# Altium schematic sheet MAPLE_CDH_Periph.SchDoc
size A4; SheetNumber: 2; SheetTotal: 2
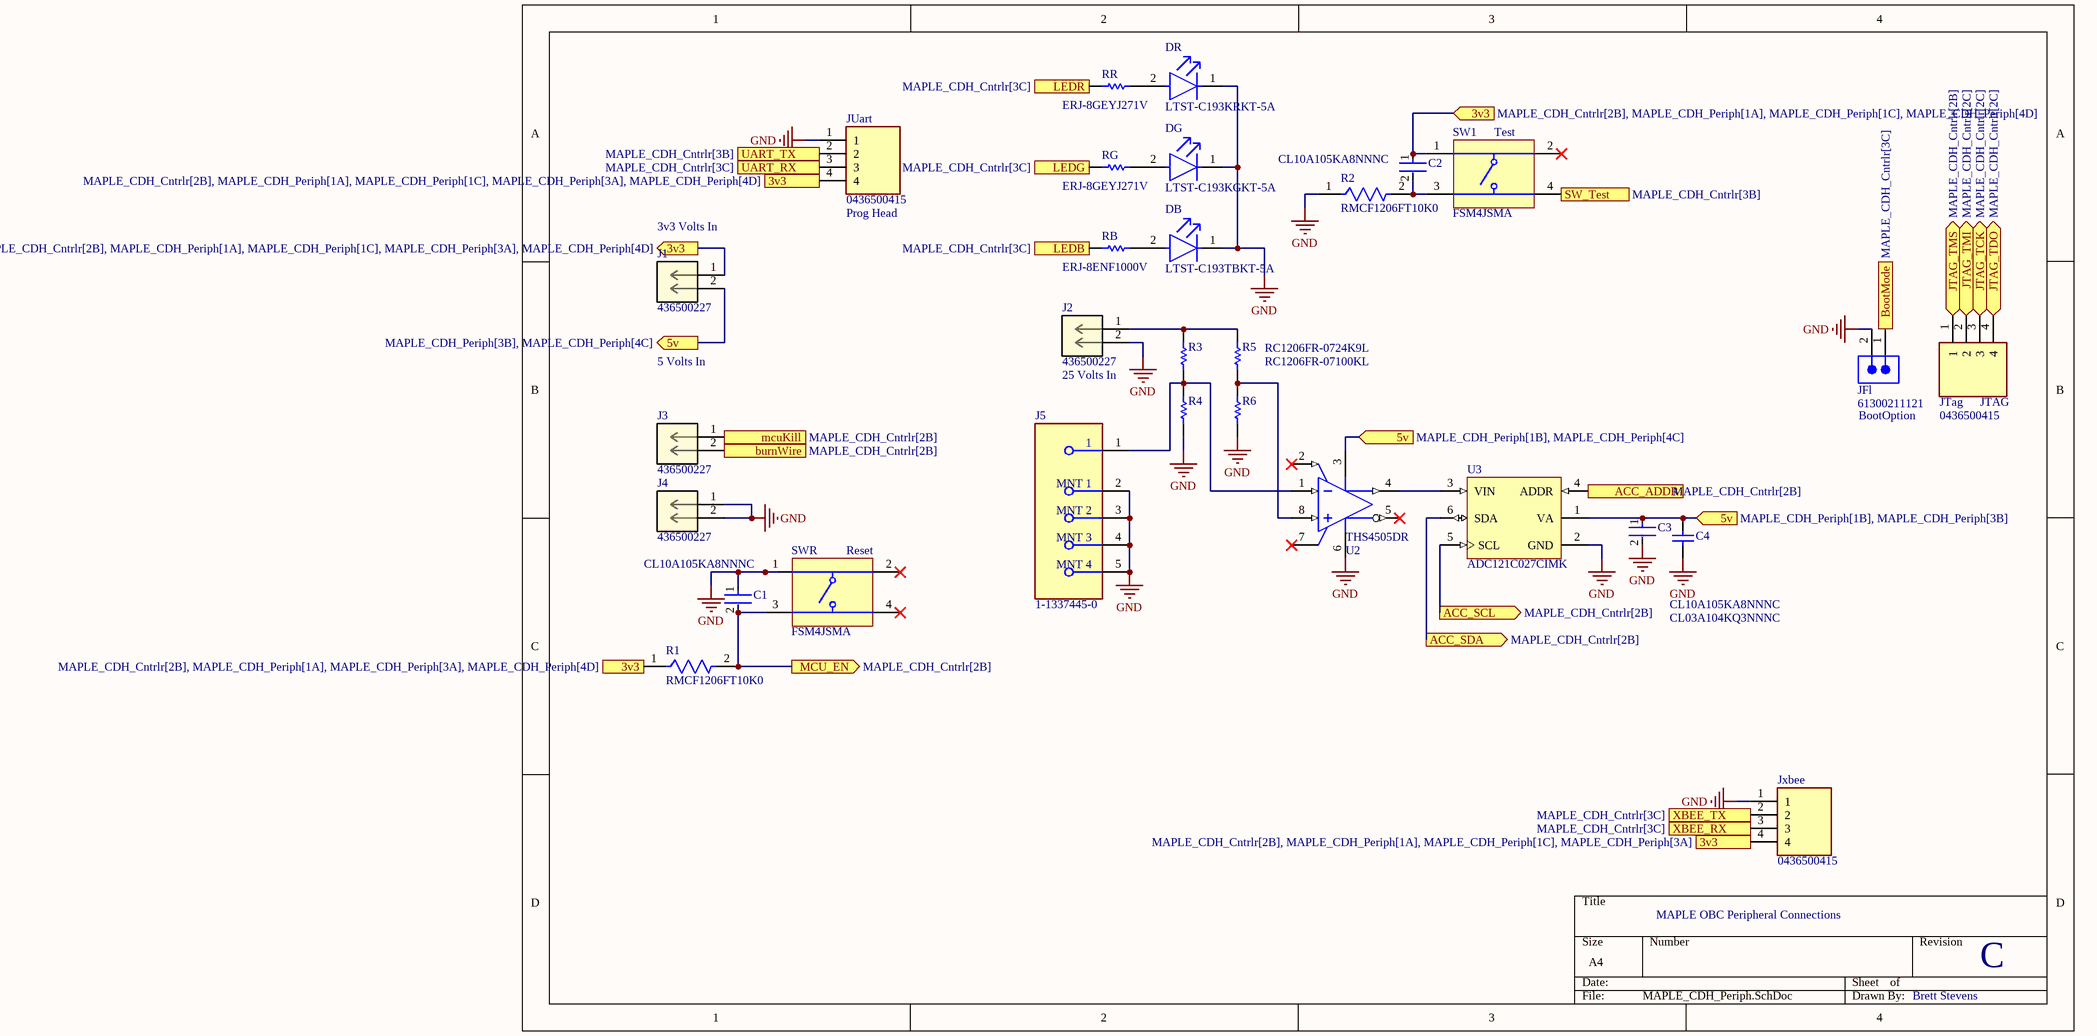
[diagram p0: MAPLE_CDH_Periph.SchDoc]

## Parts
C1  CL10A105KA8NNNC  [FP-CL10-IPC_C]
C2  CL10A105KA8NNNC  [FP-CL10-IPC_C]
C3  CL10A105KA8NNNC  [FP-CL10-IPC_C]
C4  CL03A104KQ3NNNC  [CAPC0603X33X15ML03T05]
DB  LTST-C193TBKT-5A  [FP-LTST-C193TBKT-5A-MFG]
DG  LTST-C193KGKT-5A  [FP-LTST-C193KGKT-5A-MFG]
DR  LTST-C193KRKT-5A  [FP-LTST-C193KRKT-5A-MFG]
J1  436500227  [CON_436500227_MOL]
J2  436500227  [CON_436500227_MOL]
J3  436500227  [CON_436500227_MOL]
J4  436500227  [CON_436500227_MOL]
J5  1-1337445-0  [FP-1-1337445-0-MFG]
JFl  61300211121  [61300211121]
JTag  0436500415  [MOLEX_0436500415]
JUart  0436500415  [MOLEX_0436500415]
Jxbee  0436500415  [MOLEX_0436500415]
R1  RMCF1206FT10K0  [FP-RMCF1206-IPC_B]
R2  RMCF1206FT10K0  [FP-RMCF1206-IPC_B]
R3  (no value)  [RESC3116X65X40NL10T20]
R4  (no value)  [RESC3116X65X40ML10T20]
R5  RC1206FR-0724K9L  [RESC3116X65X40NL10T20]
R6  RC1206FR-07100KL  [RESC3116X65X40ML10T20]
RB  ERJ-8ENF1000V  [RESC3216X70X50NL05T20]
RG  ERJ-8GEYJ271V  [RESC3216X70X50NL05T20]
RR  ERJ-8GEYJ271V  [RESC3216X70X50NL05T20]
SW1  FSM4JSMA  [TECO-FSM4JSMA_V]
SWR  FSM4JSMA  [TECO-FSM4JSMA_V]
U2  THS4505DR  [D0008A_L]
U3  ADC121C027CIMK  [MK06A_N]

## Ports
3v3 (in, see MAPLE_CDH_Cntrlr[2B], MAPLE_CDH_Periph[1A], MAPLE_CDH_Periph[1C], MAPLE_CDH_Periph[3A]), 3v3 (in, see MAPLE_CDH_Cntrlr[2B], MAPLE_CDH_Periph[1A], MAPLE_CDH_Periph[1C], MAPLE_CDH_Periph[3A], MAPLE_CDH_Periph[4D]), 3v3 (in, see MAPLE_CDH_Cntrlr[2B], MAPLE_CDH_Periph[1A], MAPLE_CDH_Periph[1C], MAPLE_CDH_Periph[4D]), 3v3 (in, see MAPLE_CDH_Cntrlr[2B], MAPLE_CDH_Periph[1A], MAPLE_CDH_Periph[3A], MAPLE_CDH_Periph[4D]), 3v3 (out, see MAPLE_CDH_Cntrlr[2B], MAPLE_CDH_Periph[1A], MAPLE_CDH_Periph[1C], MAPLE_CDH_Periph[3A], MAPLE_CDH_Periph[4D]), 5v (in, see MAPLE_CDH_Periph[1B], MAPLE_CDH_Periph[3B]), 5v (in, see MAPLE_CDH_Periph[1B], MAPLE_CDH_Periph[4C]), 5v (out, see MAPLE_CDH_Periph[3B], MAPLE_CDH_Periph[4C]), ACC_ADDR (in, see MAPLE_CDH_Cntrlr[2B]), ACC_SCL (out, see MAPLE_CDH_Cntrlr[2B]), ACC_SDA (out, see MAPLE_CDH_Cntrlr[2B]), BootMode (out, see MAPLE_CDH_Cntrlr[3C]), burnWire (in, see MAPLE_CDH_Cntrlr[2B]), JTAG_TCK (bidir, see MAPLE_CDH_Cntrlr[2C]), JTAG_TDO (bidir, see MAPLE_CDH_Cntrlr[2C]), JTAG_TMI (bidir, see MAPLE_CDH_Cntrlr[2C]), JTAG_TMS (bidir, see MAPLE_CDH_Cntrlr[2B]), LEDB (in, see MAPLE_CDH_Cntrlr[3C]), LEDG (in, see MAPLE_CDH_Cntrlr[3C]), LEDR (in, see MAPLE_CDH_Cntrlr[3C]), MCU_EN (out, see MAPLE_CDH_Cntrlr[2B]), mcuKill (in, see MAPLE_CDH_Cntrlr[2B]), SW_Test (out, see MAPLE_CDH_Cntrlr[3B]), UART_RX (out, see MAPLE_CDH_Cntrlr[3C]), UART_TX (in, see MAPLE_CDH_Cntrlr[3B]), XBEE_RX (out, see MAPLE_CDH_Cntrlr[3C]), XBEE_TX (in, see MAPLE_CDH_Cntrlr[3C])

## Nets
GND: C1.1 C3.2 C4.1 DB.1(C) DG.1(C) DR.1(C) J2.2 J4.1 J4.2 J5.2(MNT_1) J5.3(MNT_2) J5.4(MNT_3) J5.5(MNT_4) JFl.2 JUart.1 Jxbee.1 R2.1 R4.1 R6.1 SWR.1 U2.6(VS-) U3.2(GND)
3v3: C2.1 J1.1 JUart.4 Jxbee.4 R1.1 SW1.1 ; port 3v3
5v: C3.1 C4.2 J1.2 U2.3(VS+) U3.1(VA) ; port 5v
ACC_ADDR: U3.4(ADDR) ; port ACC_ADDR
ACC_SCL: U3.5(SCL) ; port ACC_SCL
ACC_SDA: U3.6(SDA) ; port ACC_SDA
BootMode: JFl.1 ; port BootMode
burnWire: J3.2 ; port burnWire
JTAG_TCK: JTag.3 ; port JTAG_TCK
JTAG_TDO: JTag.4 ; port JTAG_TDO
JTAG_TMI: JTag.2 ; port JTAG_TMI
JTAG_TMS: JTag.1 ; port JTAG_TMS
LEDB: RB.1 ; port LEDB
LEDG: RG.1 ; port LEDG
LEDR: RR.1 ; port LEDR
MCU_EN: C1.2 R1.2 SWR.3 ; port MCU_EN
mcuKill: J3.1 ; port mcuKill
SW_Test: SW1.4 ; port SW_Test
UART_RX: JUart.3 ; port UART_RX
UART_TX: JUart.2 ; port UART_TX
XBEE_RX: Jxbee.3 ; port XBEE_RX
XBEE_TX: Jxbee.2 ; port XBEE_TX
NetC2_2: C2.2 R2.2 SW1.3
NetDB_2: DB.2(A) RB.2
NetDG_2: DG.2(A) RG.2
NetDR_2: DR.2(A) RR.2
NetJ2_1: J2.1 R3.2 R5.2
NetJ5_1: J5.1 R3.1 R4.2 U2.1(VIN-)
NetR5_1: R5.1 R6.2 U2.8(VIN+)
NetU2_4: U2.4(VOUT+) U3.3(VIN)

Not connected (* = marked no-connect by the designer): SW1 2*; SWR 2* 4*; U2 2(VOCM)* 5(VOUT-)* 7(NC)*

## Notes on the sheet
- (near SW1) Test
- (near J1) 3v3 Volts In
- (near JUart) Prog Head
- 5 Volts In
- (near J2) 25 Volts In
- BootOption
- JTAG
- (near SWR) Reset
- MAPLE OBC Peripheral Connections
- C
- Brett Stevens

## Library data of the parts
C1-C3 = CMP-13271-004127-1: Cap Ceramic 1uF 25V X5R ±10% Pad SMD 0603 +85°C T/R; Height: 0.8mm; Capacitance: 1uF; Depth: 0.8mm; Package Quantity: 1; Mount: Surface Mount; Contact Plating: Tin; Voltage Rating: 25V; Dielectric: X5R; Packaging: Tape and Reel; Material: Ceramic; Case Code (Metric): 1608; Length: 1.6mm; Voltage: 25V; Min Operating Temperature: -55°C; Width: 0.031inch; Tolerance: 10%; Case/Package: 0603; Radiation Hardening: No; Case Code (Imperial): 0603; Thickness: 0.035inch; Lead Free: Lead Free; Max Operating Temperature: 85°C; Voltage Rating (DC): 25V
C4 = CMP-2010-00674-1: Manufacturer: Samsung; Part Number: CL03A104KQ3NNNC
DB = CMP-2000-06624-2: LED BLUE CLEAR CHIP SMD; Number of Elements: 1; Forward Voltage: 2.8V; Forward Current: 20mA; Test Current: 5mA; Lens Color: Colorless; Dominant Wavelength: 475nm; Reverse Voltage: 5V; Viewing Angle: 130°; Lens Style: Diffused; Luminous Intensity: 15mcd; Power Dissipation: 76mW; Max Operating Temperature: 80°C; Length: 1.6mm; Number of LEDs: 1; Case/Package: 0603; Case Code (Metric): 1608; Number of Pins: 2; Radiation Hardening: No; Min Operating Temperature: -20°C; Width: 0.8mm; Packaging: Tape and Reel; Package Quantity: 1; Lead Free: Lead Free; Lens Transparency: Clear; Illumination Color: Blue; Color: Blue; RoHS Compliant: Yes; Mount: Surface Mount; Depth: 0.8mm; Case Code (Imperial): 0603; Height: 0.35mm
DG = CMP-2000-06622-2: LED GREEN CLEAR CHIP SMD; Forward Current: 30mA; Power Dissipation: 75mW; Luminous Intensity: 28mcd; Lens Style: Diffused; Lens Color: Colorless; Forward Voltage: 2.3V; Test Current: 5mA; Viewing Angle: 130°; Reverse Voltage: 5V; Dominant Wavelength: 576.5nm; Number of Elements: 1; Number of Pins: 2; Case/Package: 0603; Width: 0.8mm; Radiation Hardening: No; Lead Free: Lead Free; Lens Transparency: Clear; Max Operating Temperature: 85°C; Illumination Color: Green; Color: Green; Packaging: Tape and Reel; Depth: 0.8mm; Length: 1.6mm; Mount: Surface Mount; Case Code (Imperial): 0603; Height: 0.35mm; Min Operating Temperature: -55°C; Package Quantity: 3000; Case Code (Metric): 1608; Power Rating: 75mW; Number of LEDs: 1
DR = CMP-2000-06623-2: LED RED CLEAR CHIP SMD; Power Dissipation: 50mW; Lens Style: Diffused; Test Current: 5mA; Dominant Wavelength: 631nm; Reverse Voltage: 5V; Number of Elements: 1; Viewing Angle: 130°; Luminous Intensity: 45mcd; Lens Color: Colorless; Forward Voltage: 2.3V; Case Code (Imperial): 0603; Illumination Color: Red; Lead Free: Lead Free; Radiation Hardening: No; Width: 0.8mm; Number of Pins: 2; Packaging: Tape and Reel; Depth: 0.8mm; Height: 0.35mm; Mount: Surface Mount; Case Code (Metric): 1608; Forward Current: 5mA; Lens Transparency: Clear; Case/Package: 0603; Length: 1.6mm; Color: Red; Max Operating Temperature: 85°C; Number of LEDs: 1; Min Operating Temperature: -55°C; Package Quantity: 3000
J1-J4 = 436500227: No Description Available; Mfr_Name: Molex Connector Corporation; Copyright: Copyright (C) 2023 Ultra Librarian. All rights reserved.; Manufacturer_Part_Number: 436500227; Digi-Key_Part_Number_1: WM10656-ND; RefDes: RefDes; Type: DEV
J5 = CMP-03357-000006-1: CONN BNC JACK STR 50 OHM PCB; PCB Mount Retention: With; Operating Frequency: 0 to 4Hz; PCB Mounting Orientation: Vertical; PCB Thickness: 0.126inch; Body Plating: Silver; Frequency: 4GHz; Impedance: 50R; Insulation Resistance: 5GR; Body Material: Brass; Dielectric Material: PTFE; Gender: Female; Sealable: No (Without); Number of Positions: 1; Orientation: Straight; RoHS Compliant: Yes; Min Operating Temperature: -65°C; Packaging: Bag; Fastening Type: Bayonet; Radiation Hardening: No; Max Frequency: 4GHz; Material: Brass; Contact Plating: Silver; ELV: Compliant; Depth: 12mm; Series: BNC; Package Quantity: 50; Connector Type: BNC; Contact Material: Brass; Max Operating Temperature: 165°C; Length: 12mm; Termination: Solder; Mount: Through Hole; Insulation Material: Polytetrafluoroethylene
JFl = CMP-1712-00002-5: NexarPartId: 20081794; Operating Supply Voltage: 250V; Current Rating: 3A; Gender: Male; Number of Contacts: 2; Pitch: 2.54mm; Connector Type: Male Pin; Contact Resistance: 20mΩ; Contact Plating: Gold; Contact Material: Copper; Number of Pins: 2; Min Operating Temperature: -40°C; Packaging: Bulk; Lead Pitch: 2.54mm; Mount: Through Hole; Orientation: Vertical; RoHS: Compliant; REACH SVHC: No SVHC; Height: 8.94mm; Termination: Through Hole; Number of Positions: 2; Contact Mating Length: 5.9944mm; Color: Black; Contact Gender: Male; Number of Rows: 1; Housing Material: PBT; Lead Free: Lead Free; Voltage Rating: 250V; Max Operating Temperature: 125°C
JTag JUart Jxbee = 0436500415: Connector Header Through Hole 4 position 0.118 (3.00mm); MF: Molex; MP: 0436500415; Price: None; SnapEDA_Link: https://www.snapeda.com/parts/0436500415/Molex/view-part/425083/?ref=snap; Availability: Unavailable; Value: *; Package: None
R1 R2 = CMP-26527-000151-1: 10kΩ ±1% 0.25W 1206 Thick Film Chip Resistor AEC-Q200 compliant; Resistance: 10kR; Temperature Coefficient: 100ppm/°C; Max Power Dissipation: 250mW; Packaging: Tape and Reel; Resistor Type: Thick Film; Number of Terminations: 2; Depth: 1.6mm; Military Standard: Not; Contact Plating: Tin; Radiation Hardening: No; Lead Free: Lead Free; Tolerance: 1%; Length: 3.2mm; Size Code: 1206; RoHS Compliant: Yes; Case/Package: 1206; Mount: Surface Mount; Features: Automotive AEC-Q200; Min Operating Temperature: -55°C; Series: RMCF; Case Code (Imperial): 1206; Construction: Rectangular; Max Operating Temperature: 155°C; Width: 0.063inch; Height: 0.028inch; Power Rating: 250mW; Case Code (Metric): 3216
R3 = CMP-2003-03636-1: Manufacturer: Yageo; Part Number: RC1206FR-0724K9L
R4 R6 = CMP-2100-03674-1: Chip Resistor, 100 KOhm, +/- 1%, 0.25 W, -55 to 155 degC, 1206 (3216 Metric), RoHS, Tape and Reel; Manufacturer: Yageo; Voltage Rating: 200V; Temperature Coefficient: 100ppm/degreesC; Power Rating: 250mW; Case Code (Metric): 3216; Composition: ThickFilm; Lead Free: LeadFree; Max Operating Temperature: 155degC; Case/Package: 1206; Min Operating Temperature: -55degC; Depth: 1.6mm; RoHSCompliant: true; Datasheet URL: http://www.yageo.com/NewPortal/yageodocoutput?fileName=/pdf/R-Chip/PYu-RC_Group_51_RoHS_L_5.pdf; Datasheet Version: Rev. 5, 10/2016; Package Reference: 1206.0; Packaging: TapeandReel; Resistance: 100KOhm; Manufacturer URL: http://www.yageo.com/; Tolerance: 1%; Height: 0.55mm; REACH SVHC: NoSVHC; Case Code (Imperial): 1206; Length: 3.1mm; Package Description: 2-Pin Surface Mount Device, Body 3.1 x 1.6 mm; Termination: SMD/SMT
R5 = CMP-2003-03636-1: Manufacturer: Yageo; Part Number: RC1206FR-0724K9L
RB = CMP-2003-00016-1: Manufacturer: Panasonic; Part Number: ERJ-8ENF1000V
RG RR = CMP-2003-00597-1: Manufacturer: Panasonic; Part Number: ERJ-8GEYJ271V
SW1 SWR = CMP-2000-05602-2: Swicth, SPST, 24 V, -35 to 85 degC, 4-Pin SMD, RoHS, Tape and Reel; Manufacturer: TE Connectivity; Switch Travel: 0.25mm; Mechanical Life: 100000Cycles; Contact Current Rating: 50mA; Operating Force: 1.57N; Actuator Material: Polyamide; Contact Resistance: 100mOhm; Voltage Rating: 24V; Illumination Type: Illuminated; Actuator Length: 0.055inch; Max Voltage Rating (DC): 12V; Case\/Package: SMD/SMT; Orientation: Straight; Datasheet URL: http://www.te.com/commerce/DocumentDelivery/DDEController?Action=showdoc&DocId=Customer+Drawing%7F2-1437565-7%7FV%7Fpdf%7FEnglish%7FENG_CD_2-1437565-7_V.pdf%7F4-1437565-2; Min Operating Temperature: -35degC; Packaging: LoosePiece; Termination: GullWing; Throw Configuration: SPST; Package Description: 4-Pin Surface Mount Device, Body 6 x 6 mm, Pitch 4.5 mm; Mounting Technology: SurfaceMount; Contact Plating: Silver; Datasheet Version: Rev. V, 02/2015; RoHSCompliant: true; Max Operating Temperature: 85degC; Length: 6mm; Voltage Rating (DC): 24V; Electrical Life: 100000Cycles; Current Rating: 50mA; Package Quantity: 750; Mount: SurfaceMount; Package Reference: FSM4JSMA; Manufacturer URL: http://www.te.com/; Width: 6mm; REACH SVHC: Unknown; Contact Material: CopperAlloy
U2 = CMP-0811-00031-2: Wideband, Low-Distortion Fully Differential Amplifier, 4.5 to 15 V, -40 to 85 degC, 8-pin SOIC (D8), Green (RoHS & no Sb/Br); Manufacturer: Texas Instruments; 3rd Harmonic(dBc): 65; @ MHz: 30; BW @ Acl(MHz): 260; THD (Fc is 1 MHz)(Typ)(dB): -78; Offset Voltage Drift (+/-)(Max)(uV/Degrees Celsius: 10; Vn at Flatband(Typ)(nV/rtHz): 8; Vio(Max)(mV): -7; Vs(Min)(V): 4.5; Vs(Max)(V): 15; Number of Channels: 1; Io(Typ)(mA): 100; Iq per channel(Max)(mA): 21; Slew Rate(Typ)(V/us): 1800; 2nd Harmonic(dBc): 66; Settling Time (0.1%)(Typ)(ns): 20; ComponentLink3Description: Package Specification; ComponentLink1URL: http://www.ti.com/; DatasheetVersion: SLOS363D; Eco-Plan: Green (RoHS & no Sb/Br); SubFamily: Fully Differential Amplifier; ComponentLink2Description: Datasheet; ComponentLink1Description: Manufacturer URL; PartNumber: THS4505DR; Code_JEDEC: MS-012; ComponentLink2URL: http://www.ti.com/general/docs/lit/getliterature.tsp?genericPartNumber=THS4505&fileType=pdf; Mounting Technology: Surface Mount; ComponentLink3URL: http://www.ti.com/litv/pdf/msoi002j; PackageDescription: 8-Pin Plastic Small Outline, Body 4.9 x 3.9 mm, Pitch 1.27 mm; PackageReference: D0008A; PackageVersion: 4040047-3/M, 06/2011
U3 = CMP-0054-00264-2: I2C-Compatible, 12-Bit Analog-to-Digital Converter with Alert Function, 6-pin Tiny SOT23; Manufacturer: National Semiconductor; PackageTopMarking: X31C*XTT; PowerWise: Y; CompType: ADC IC; PackageVersion: revE, Nov-2008; ComponentLink1URL: http://www.national.com/ds/AD/ADC121C027.pdf; Code_IPC: SOT26A-6; ComponentLink3Description: MK06A Package Page; Code_JEDEC: MO-193-AA; ComponentLink2Description: ADC121C027 Web Page; ComponentLink1Description: ADC121C027 Datasheet; RevisionNote: Component URLs added; DatasheetVersion: Apr-2009; RoHS: N; PackageDescription: Molded TSOT, 2.97 x 1.65 x 0.87mm Body, 6 Lead, 0.95mm Pitch; ComponentLink3URL: http://www.national.com/packaging/folders/mk06a.html; PackageReference: MK06A; ComponentLink2URL: http://www.national.com/pf/AD/ADC121C027.html; PinCount: 6